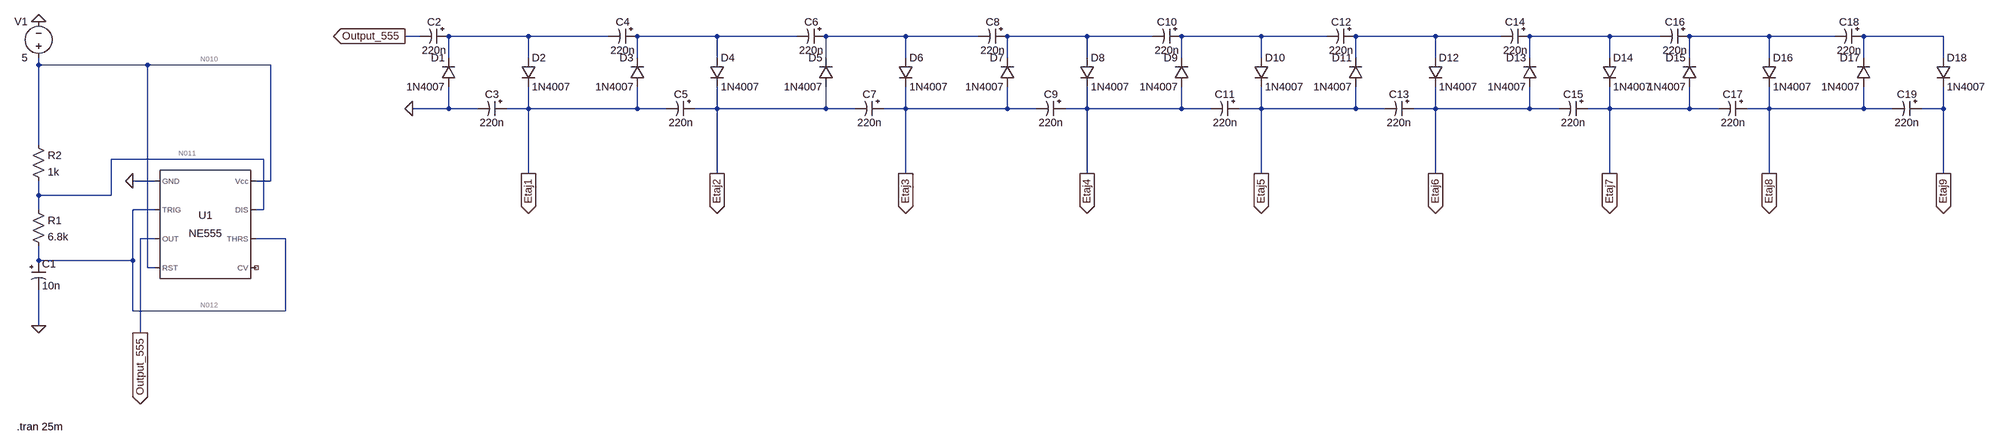
[diagram p0: schematic Multiplicator de tensiune.asc]
Multiplicator de tensiune.asc, the LTspice schematic file:
Version 4.1
SHEET 1 4152 680
WIRE 688 -304 656 -304
WIRE 928 -304 752 -304
WIRE 1104 -304 928 -304
WIRE 1344 -304 1168 -304
WIRE 1520 -304 1344 -304
WIRE 1760 -304 1584 -304
WIRE 1920 -304 1760 -304
WIRE 2160 -304 1984 -304
WIRE 2304 -304 2160 -304
WIRE 2544 -304 2368 -304
WIRE 2688 -304 2544 -304
WIRE 2928 -304 2752 -304
WIRE 3072 -304 2928 -304
WIRE 3312 -304 3136 -304
WIRE 3424 -304 3312 -304
WIRE 3664 -304 3488 -304
WIRE 3808 -304 3664 -304
WIRE 4048 -304 3872 -304
WIRE 752 -256 752 -304
WIRE 928 -256 928 -304
WIRE 1168 -256 1168 -304
WIRE 1344 -256 1344 -304
WIRE 1584 -256 1584 -304
WIRE 1760 -256 1760 -304
WIRE 1984 -256 1984 -304
WIRE 2160 -256 2160 -304
WIRE 2368 -256 2368 -304
WIRE 2544 -256 2544 -304
WIRE 2752 -256 2752 -304
WIRE 2928 -256 2928 -304
WIRE 3136 -256 3136 -304
WIRE 3312 -256 3312 -304
WIRE 3488 -256 3488 -304
WIRE 3664 -256 3664 -304
WIRE 3872 -256 3872 -304
WIRE 4048 -256 4048 -304
WIRE -192 -240 -192 -256
WIRE 48 -240 -192 -240
WIRE 320 -240 48 -240
WIRE 752 -144 752 -192
WIRE 752 -144 672 -144
WIRE 816 -144 752 -144
WIRE 928 -144 928 -192
WIRE 928 -144 880 -144
WIRE 1168 -144 1168 -192
WIRE 1168 -144 928 -144
WIRE 1232 -144 1168 -144
WIRE 1344 -144 1344 -192
WIRE 1344 -144 1296 -144
WIRE 1584 -144 1584 -192
WIRE 1584 -144 1344 -144
WIRE 1648 -144 1584 -144
WIRE 1760 -144 1760 -192
WIRE 1760 -144 1712 -144
WIRE 1984 -144 1984 -192
WIRE 1984 -144 1760 -144
WIRE 2048 -144 1984 -144
WIRE 2160 -144 2160 -192
WIRE 2160 -144 2112 -144
WIRE 2368 -144 2368 -192
WIRE 2368 -144 2160 -144
WIRE 2432 -144 2368 -144
WIRE 2544 -144 2544 -192
WIRE 2544 -144 2496 -144
WIRE 2752 -144 2752 -192
WIRE 2752 -144 2544 -144
WIRE 2816 -144 2752 -144
WIRE 2928 -144 2928 -192
WIRE 2928 -144 2880 -144
WIRE 3136 -144 3136 -192
WIRE 3136 -144 2928 -144
WIRE 3200 -144 3136 -144
WIRE 3312 -144 3312 -192
WIRE 3312 -144 3264 -144
WIRE 3488 -144 3488 -192
WIRE 3488 -144 3312 -144
WIRE 3552 -144 3488 -144
WIRE 3664 -144 3664 -192
WIRE 3664 -144 3616 -144
WIRE 3872 -144 3872 -192
WIRE 3872 -144 3664 -144
WIRE 3936 -144 3872 -144
WIRE 4048 -144 4048 -192
WIRE 4048 -144 4000 -144
WIRE -192 -64 -192 -240
WIRE 304 -32 -32 -32
WIRE 928 0 928 -144
WIRE 1344 0 1344 -144
WIRE 1760 0 1760 -144
WIRE 2160 0 2160 -144
WIRE 2544 0 2544 -144
WIRE 2928 0 2928 -144
WIRE 3312 0 3312 -144
WIRE 3664 0 3664 -144
WIRE 4048 0 4048 -144
WIRE 64 16 16 16
WIRE 320 16 320 -240
WIRE 320 16 288 16
WIRE -192 48 -192 16
WIRE -32 48 -32 -32
WIRE -32 48 -192 48
WIRE -192 80 -192 48
WIRE 64 80 16 80
WIRE 304 80 304 -32
WIRE 304 80 288 80
WIRE 64 144 32 144
WIRE 352 144 288 144
WIRE -192 192 -192 160
WIRE 16 192 16 80
WIRE 16 192 -192 192
WIRE 48 208 48 -240
WIRE 64 208 48 208
WIRE 16 304 16 192
WIRE 352 304 352 144
WIRE 352 304 16 304
WIRE -192 336 -192 256
WIRE 32 352 32 144
FLAG -192 336 0
FLAG 16 16 0
FLAG 32 352 Output_555
IOPIN 32 352 Out
FLAG -192 -336 0
FLAG 656 -304 Output_555
IOPIN 656 -304 Out
FLAG 672 -144 0
FLAG 928 0 Etaj1
IOPIN 928 0 Out
FLAG 1344 0 Etaj2
IOPIN 1344 0 Out
FLAG 1760 0 Etaj3
IOPIN 1760 0 Out
FLAG 2160 0 Etaj4
IOPIN 2160 0 Out
FLAG 2544 0 Etaj5
IOPIN 2544 0 Out
FLAG 2928 0 Etaj6
IOPIN 2928 0 Out
FLAG 3312 0 Etaj7
IOPIN 3312 0 Out
FLAG 3664 0 Etaj8
IOPIN 3664 0 Out
FLAG 4048 0 Etaj9
IOPIN 4048 0 Out
SYMBOL res -208 64 R0
SYMATTR InstName R1
SYMATTR Value 6.8k
SYMBOL res -208 -80 R0
SYMATTR InstName R2
SYMATTR Value 1k
SYMBOL polcap -208 192 R0
SYMATTR InstName C1
SYMATTR Value 10n
SYMBOL voltage -192 -240 R180
WINDOW 0 24 96 Left 2
WINDOW 3 24 16 Left 2
WINDOW 123 0 0 Left 0
WINDOW 39 0 0 Left 0
SYMATTR InstName V1
SYMATTR Value 5
SYMBOL Misc\\NE555 176 112 R0
SYMATTR InstName U1
SYMBOL polcap 752 -320 R90
WINDOW 0 0 32 VBottom 2
WINDOW 3 32 32 VTop 2
SYMATTR InstName C2
SYMATTR Value 220n
SYMBOL polcap 880 -160 R90
WINDOW 0 0 32 VBottom 2
WINDOW 3 32 32 VTop 2
SYMATTR InstName C3
SYMATTR Value 220n
SYMBOL diode 768 -192 R180
WINDOW 0 24 64 Left 2
WINDOW 3 24 0 Left 2
SYMATTR InstName D1
SYMATTR Value 1N4007
SYMBOL diode 912 -256 R0
SYMATTR InstName D2
SYMATTR Value 1N4007
SYMBOL polcap 1168 -320 R90
WINDOW 0 0 32 VBottom 2
WINDOW 3 32 32 VTop 2
SYMATTR InstName C4
SYMATTR Value 220n
SYMBOL polcap 1296 -160 R90
WINDOW 0 0 32 VBottom 2
WINDOW 3 32 32 VTop 2
SYMATTR InstName C5
SYMATTR Value 220n
SYMBOL diode 1184 -192 R180
WINDOW 0 24 64 Left 2
WINDOW 3 24 0 Left 2
SYMATTR InstName D3
SYMATTR Value 1N4007
SYMBOL diode 1328 -256 R0
SYMATTR InstName D4
SYMATTR Value 1N4007
SYMBOL polcap 1584 -320 R90
WINDOW 0 0 32 VBottom 2
WINDOW 3 32 32 VTop 2
SYMATTR InstName C6
SYMATTR Value 220n
SYMBOL polcap 1712 -160 R90
WINDOW 0 0 32 VBottom 2
WINDOW 3 32 32 VTop 2
SYMATTR InstName C7
SYMATTR Value 220n
SYMBOL diode 1600 -192 R180
WINDOW 0 24 64 Left 2
WINDOW 3 24 0 Left 2
SYMATTR InstName D5
SYMATTR Value 1N4007
SYMBOL diode 1744 -256 R0
SYMATTR InstName D6
SYMATTR Value 1N4007
SYMBOL polcap 1984 -320 R90
WINDOW 0 0 32 VBottom 2
WINDOW 3 32 32 VTop 2
SYMATTR InstName C8
SYMATTR Value 220n
SYMBOL polcap 2112 -160 R90
WINDOW 0 0 32 VBottom 2
WINDOW 3 32 32 VTop 2
SYMATTR InstName C9
SYMATTR Value 220n
SYMBOL diode 2000 -192 R180
WINDOW 0 24 64 Left 2
WINDOW 3 24 0 Left 2
SYMATTR InstName D7
SYMATTR Value 1N4007
SYMBOL diode 2144 -256 R0
SYMATTR InstName D8
SYMATTR Value 1N4007
SYMBOL polcap 2368 -320 R90
WINDOW 0 0 32 VBottom 2
WINDOW 3 32 32 VTop 2
SYMATTR InstName C10
SYMATTR Value 220n
SYMBOL polcap 2496 -160 R90
WINDOW 0 0 32 VBottom 2
WINDOW 3 32 32 VTop 2
SYMATTR InstName C11
SYMATTR Value 220n
SYMBOL diode 2384 -192 R180
WINDOW 0 24 64 Left 2
WINDOW 3 24 0 Left 2
SYMATTR InstName D9
SYMATTR Value 1N4007
SYMBOL diode 2528 -256 R0
SYMATTR InstName D10
SYMATTR Value 1N4007
SYMBOL polcap 2752 -320 R90
WINDOW 0 0 32 VBottom 2
WINDOW 3 32 32 VTop 2
SYMATTR InstName C12
SYMATTR Value 220n
SYMBOL polcap 2880 -160 R90
WINDOW 0 0 32 VBottom 2
WINDOW 3 32 32 VTop 2
SYMATTR InstName C13
SYMATTR Value 220n
SYMBOL diode 2768 -192 R180
WINDOW 0 24 64 Left 2
WINDOW 3 24 0 Left 2
SYMATTR InstName D11
SYMATTR Value 1N4007
SYMBOL diode 2912 -256 R0
SYMATTR InstName D12
SYMATTR Value 1N4007
SYMBOL polcap 3136 -320 R90
WINDOW 0 0 32 VBottom 2
WINDOW 3 32 32 VTop 2
SYMATTR InstName C14
SYMATTR Value 220n
SYMBOL polcap 3264 -160 R90
WINDOW 0 0 32 VBottom 2
WINDOW 3 32 32 VTop 2
SYMATTR InstName C15
SYMATTR Value 220n
SYMBOL diode 3152 -192 R180
WINDOW 0 24 64 Left 2
WINDOW 3 24 0 Left 2
SYMATTR InstName D13
SYMATTR Value 1N4007
SYMBOL diode 3296 -256 R0
SYMATTR InstName D14
SYMATTR Value 1N4007
SYMBOL polcap 3488 -320 R90
WINDOW 0 0 32 VBottom 2
WINDOW 3 32 32 VTop 2
SYMATTR InstName C16
SYMATTR Value 220n
SYMBOL polcap 3616 -160 R90
WINDOW 0 0 32 VBottom 2
WINDOW 3 32 32 VTop 2
SYMATTR InstName C17
SYMATTR Value 220n
SYMBOL diode 3504 -192 R180
WINDOW 0 24 64 Left 2
WINDOW 3 24 0 Left 2
SYMATTR InstName D15
SYMATTR Value 1N4007
SYMBOL diode 3648 -256 R0
SYMATTR InstName D16
SYMATTR Value 1N4007
SYMBOL polcap 3872 -320 R90
WINDOW 0 0 32 VBottom 2
WINDOW 3 32 32 VTop 2
SYMATTR InstName C18
SYMATTR Value 220n
SYMBOL polcap 4000 -160 R90
WINDOW 0 0 32 VBottom 2
WINDOW 3 32 32 VTop 2
SYMATTR InstName C19
SYMATTR Value 220n
SYMBOL diode 3888 -192 R180
WINDOW 0 24 64 Left 2
WINDOW 3 24 0 Left 2
SYMATTR InstName D17
SYMATTR Value 1N4007
SYMBOL diode 4032 -256 R0
SYMATTR InstName D18
SYMATTR Value 1N4007
TEXT -240 560 Left 2 !.tran 25m

The netlist it stands for:
* Multiplicator de tensiune.asc
R1 N011 N012 6.8k
R2 N010 N011 1k
C1 N012 0 10n
V1 N010 0 5
X§U1 0 N012 Output_555 N010 NC_01 N012 N011 N010 NE555  ; pins GND TRIG OUT RST CV THRS DIS Vcc
C2 N001 Output_555 220n
C3 Etaj1 0 220n
D1 0 N001 1N4007
D2 N001 Etaj1 1N4007
C4 N002 N001 220n
C5 Etaj2 Etaj1 220n
D3 Etaj1 N002 1N4007
D4 N002 Etaj2 1N4007
C6 N003 N002 220n
C7 Etaj3 Etaj2 220n
D5 Etaj2 N003 1N4007
D6 N003 Etaj3 1N4007
C8 N004 N003 220n
C9 Etaj4 Etaj3 220n
D7 Etaj3 N004 1N4007
D8 N004 Etaj4 1N4007
C10 N005 N004 220n
C11 Etaj5 Etaj4 220n
D9 Etaj4 N005 1N4007
D10 N005 Etaj5 1N4007
C12 N006 N005 220n
C13 Etaj6 Etaj5 220n
D11 Etaj5 N006 1N4007
D12 N006 Etaj6 1N4007
C14 N007 N006 220n
C15 Etaj7 Etaj6 220n
D13 Etaj6 N007 1N4007
D14 N007 Etaj7 1N4007
C16 N008 N007 220n
C17 Etaj8 Etaj7 220n
D15 Etaj7 N008 1N4007
D16 N008 Etaj8 1N4007
C18 N009 N008 220n
C19 Etaj9 Etaj8 220n
D17 Etaj8 N009 1N4007
D18 N009 Etaj9 1N4007
.model D D
.lib standard.dio
.tran 25m
.lib NE555.sub
.backanno
.end

* Results of the author's LTspice run, read from the files saved beside the schematic
* Operating Point, zero values left out:
*   V(n010) = 5 V
*   V(n011) = 5 V
*   V(n012) = 5 V
*   V(output_555) = 5 V
*   I(R1) = 10 nA
*   I(R2) = 16.67 nA
*   I(V1) = -1.611 mA
*   Ix(u1:1) = -1.611 mA
*   Ix(u1:2) = 5 nA
*   Ix(u1:4) = 22.67 µA
*   Ix(u1:6) = 5 nA
*   Ix(u1:7) = 6.672 nA
*   Ix(u1:8) = 1.588 mA